# EAGLE schematic Low Voltage Regulator-pass pnp (EAGLE 6.5.0)
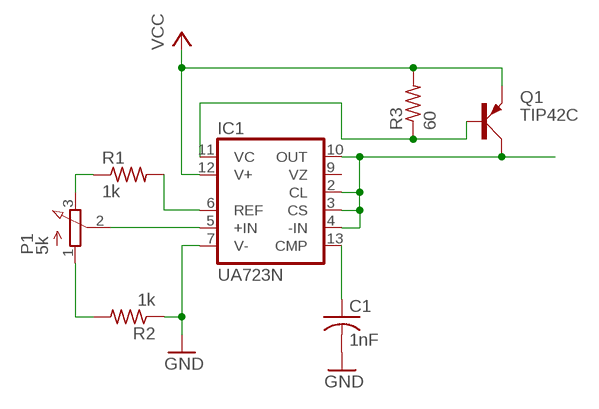
[diagram p0: schematic, sheet 1]

## Parts
C1  1nF  C-US050-025X075  [C050-025X075]
IC1  UA723N  [DIL14]
P1  5k  3RP/1610N  [3RP/1610N]
Q1  TIP42C  [TO220AV]
R1  1k  R-US_0207/10  [0207/10]
R2  1k  R-US_0207/10  [0207/10]
R3  60  R-US_0207/10  [0207/10]

## Nets
GND: C1.2 IC1.7(V-) R2.1
N$1: IC1.6(REF) R1.2
N$2: IC1.5(+IN) P1.2(S)
N$3: P1.3(E) R1.1
N$4: C1.1 IC1.13(CMP)
N$5: IC1.2(CL) IC1.3(CS) IC1.4(-IN) IC1.10(OUT) Q1.C
N$6: P1.1(A) R2.2
N$7: IC1.11(VC) Q1.B R3.1
VCC: IC1.12(V+) Q1.E R3.2
Unconnected: IC1.9(VZ)

## Library data of the parts
C1 = rcl:C-US: CAPACITOR, American symbol
IC1 = linear:*723: Positive VOLTAGE REGULATOR
P1 = pot:3RP/1610N: 16mm Potentiometer one level Source: http://www.alphapotentiometers.net/html/16mm_pot_2.html
Q1 = transistor-power:TIP42C: PNP TRANSISTOR
R1-R3 = rcl:R-US_: RESISTOR, American symbol